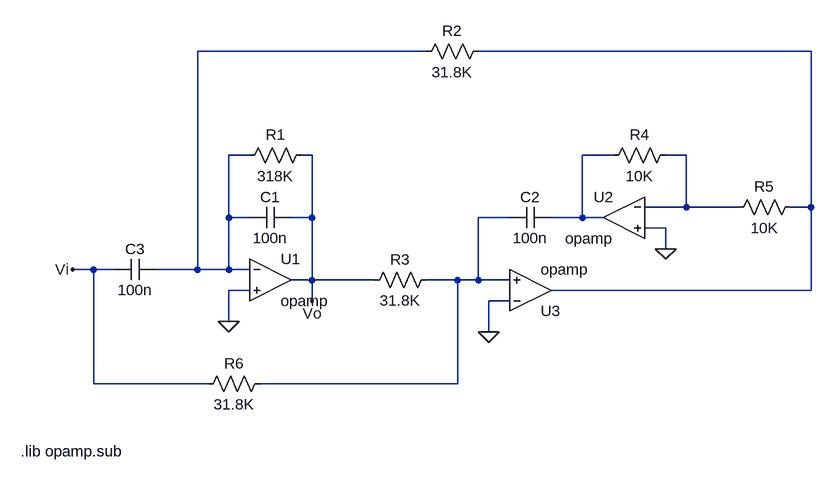
[diagram p0: schematic ej8guia3.asc]
ej8guia3.asc, the LTspice schematic file:
Version 4
SHEET 1 1000 680
WIRE 400 -144 48 -144
WIRE 992 -144 480 -144
WIRE 128 16 96 16
WIRE 224 16 208 16
WIRE 688 16 640 16
WIRE 800 16 768 16
WIRE 800 96 800 16
WIRE 800 96 736 96
WIRE 880 96 800 96
WIRE 992 96 992 -144
WIRE 992 96 960 96
WIRE 96 112 96 16
WIRE 128 112 96 112
WIRE 224 112 224 16
WIRE 224 112 192 112
WIRE 528 112 480 112
WIRE 640 112 640 16
WIRE 640 112 592 112
WIRE 672 112 640 112
WIRE 768 128 736 128
WIRE 768 160 768 128
WIRE -112 192 -144 192
WIRE -80 192 -112 192
WIRE 48 192 48 -144
WIRE 48 192 -16 192
WIRE 96 192 96 112
WIRE 96 192 48 192
WIRE 128 192 96 192
WIRE 224 208 224 112
WIRE 224 208 192 208
WIRE 320 208 224 208
WIRE 448 208 400 208
WIRE 480 208 480 112
WIRE 480 208 448 208
WIRE 528 208 480 208
WIRE 128 224 96 224
WIRE 992 224 992 96
WIRE 992 224 592 224
WIRE 224 240 224 208
WIRE 528 240 496 240
WIRE 96 272 96 224
WIRE 496 288 496 240
WIRE -112 368 -112 192
WIRE 64 368 -112 368
WIRE 448 368 448 208
WIRE 448 368 144 368
FLAG 768 160 0
FLAG 496 288 0
FLAG 96 272 0
FLAG -144 192 Vi
FLAG 224 240 Vo
SYMBOL cap 192 96 R90
WINDOW 0 0 32 VBottom 2
WINDOW 3 32 32 VTop 2
SYMATTR InstName C1
SYMATTR Value 100n
SYMBOL cap 592 96 R90
WINDOW 0 0 32 VBottom 2
WINDOW 3 32 32 VTop 2
SYMATTR InstName C2
SYMATTR Value 100n
SYMBOL cap -16 176 R90
WINDOW 0 0 32 VBottom 2
WINDOW 3 32 32 VTop 2
SYMATTR InstName C3
SYMATTR Value 100n
SYMBOL res 224 0 R90
WINDOW 0 0 56 VBottom 2
WINDOW 3 32 56 VTop 2
SYMATTR InstName R1
SYMATTR Value 318K
SYMBOL res 496 -160 R90
WINDOW 0 0 56 VBottom 2
WINDOW 3 32 56 VTop 2
SYMATTR InstName R2
SYMATTR Value 31.8K
SYMBOL res 416 192 R90
WINDOW 0 0 56 VBottom 2
WINDOW 3 32 56 VTop 2
SYMATTR InstName R3
SYMATTR Value 31.8K
SYMBOL res 784 0 R90
WINDOW 0 0 56 VBottom 2
WINDOW 3 32 56 VTop 2
SYMATTR InstName R4
SYMATTR Value 10K
SYMBOL res 976 80 R90
WINDOW 0 0 56 VBottom 2
WINDOW 3 32 56 VTop 2
SYMATTR InstName R5
SYMATTR Value 10K
SYMBOL res 160 352 R90
WINDOW 0 0 56 VBottom 2
WINDOW 3 32 56 VTop 2
SYMATTR InstName R6
SYMATTR Value 31.8K
SYMBOL OpAmps\\opamp 160 144 R0
SYMATTR InstName U1
SYMBOL OpAmps\\opamp 704 48 M0
SYMATTR InstName U2
SYMBOL OpAmps\\opamp 560 288 M180
SYMATTR InstName U3
TEXT -224 472 Left 2 !.lib opamp.sub

The netlist it stands for:
* ej8guia3.asc
C1 Vo N001 100n
C2 N003 N005 100n
C3 N001 Vi 100n
R1 Vo N001 318K
R2 N002 N001 31.8K
R3 N005 Vo 31.8K
R4 N004 N003 10K
R5 N002 N004 10K
R6 N005 Vi 31.8K
XU1 N001 0 Vo opamp Aol=100K GBW=10Meg  ; pins invin noninvin out
XU2 N004 0 N003 opamp Aol=100K GBW=10Meg  ; pins invin noninvin out
XU3 0 N005 N002 opamp Aol=100K GBW=10Meg  ; pins invin noninvin out
.lib opamp.sub
.backanno
.end